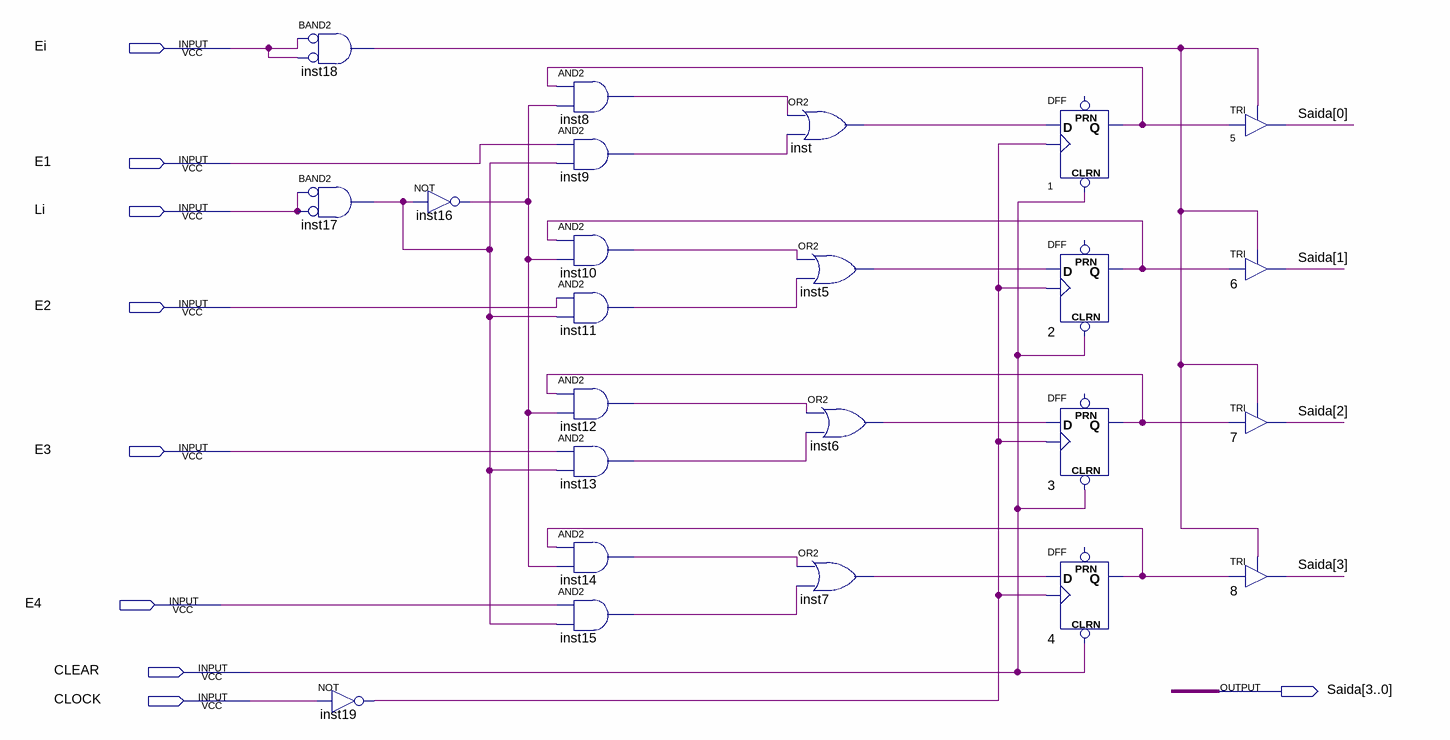
[diagram p0: schematic sheet]
// Quartus schematic Registrador_de_instrucoes.bdf as structural Verilog: 24 symbols, 9 pins
module Registrador_de_instrucoes (
  input  Ei,
  input  E1,
  input  Li,
  input  E2,
  input  E3,
  input  E4,
  input  CLEAR,
  input  CLOCK,
  output [3:0] Saida
);

  wire inst5_out, inst6_out, inst7_out, inst8_out, inst9_out, inst10_out, inst11_out, inst12_out, inst13_out,
       inst14_out, inst15_out, inst16_out, inst17_out, inst18_out, inst19_out, inst_out, n1_q, n2_q, n3_q,
       n4_q;

  and inst18 (inst18_out, ~Ei, ~Ei);  // BAND2
  and inst17 (inst17_out, ~Li, ~Li);  // BAND2
  not inst19 (inst19_out, CLOCK);
  not inst16 (inst16_out, inst17_out);
  and inst8 (inst8_out, n1_q, inst16_out);
  and inst9 (inst9_out, E1, inst17_out);
  and inst10 (inst10_out, n2_q, inst16_out);
  and inst11 (inst11_out, E2, inst17_out);
  and inst12 (inst12_out, n3_q, inst16_out);
  and inst13 (inst13_out, E3, inst17_out);
  and inst14 (inst14_out, n4_q, inst16_out);
  and inst15 (inst15_out, E4, inst17_out);
  or inst (inst_out, inst8_out, inst9_out);
  or inst5 (inst5_out, inst10_out, inst11_out);
  or inst6 (inst6_out, inst12_out, inst13_out);
  or inst7 (inst7_out, inst14_out, inst15_out);
  DFF u_1 (.CLRN(CLEAR), .CLK(inst19_out), .D(inst_out), .Q(n1_q));  // open: PRN
  DFF u_2 (.CLRN(CLEAR), .CLK(inst19_out), .D(inst5_out), .Q(n2_q));  // open: PRN
  DFF u_3 (.CLRN(CLEAR), .CLK(inst19_out), .D(inst6_out), .Q(n3_q));  // open: PRN
  DFF u_4 (.CLRN(CLEAR), .CLK(inst19_out), .D(inst7_out), .Q(n4_q));  // open: PRN
  TRI u_5 (.IN(n1_q), .OE(inst18_out), .OUT(Saida[0]));
  TRI u_6 (.IN(n2_q), .OE(inst18_out), .OUT(Saida[1]));
  TRI u_7 (.IN(n3_q), .OE(inst18_out), .OUT(Saida[2]));
  TRI u_8 (.IN(n4_q), .OE(inst18_out), .OUT(Saida[3]));
endmodule
